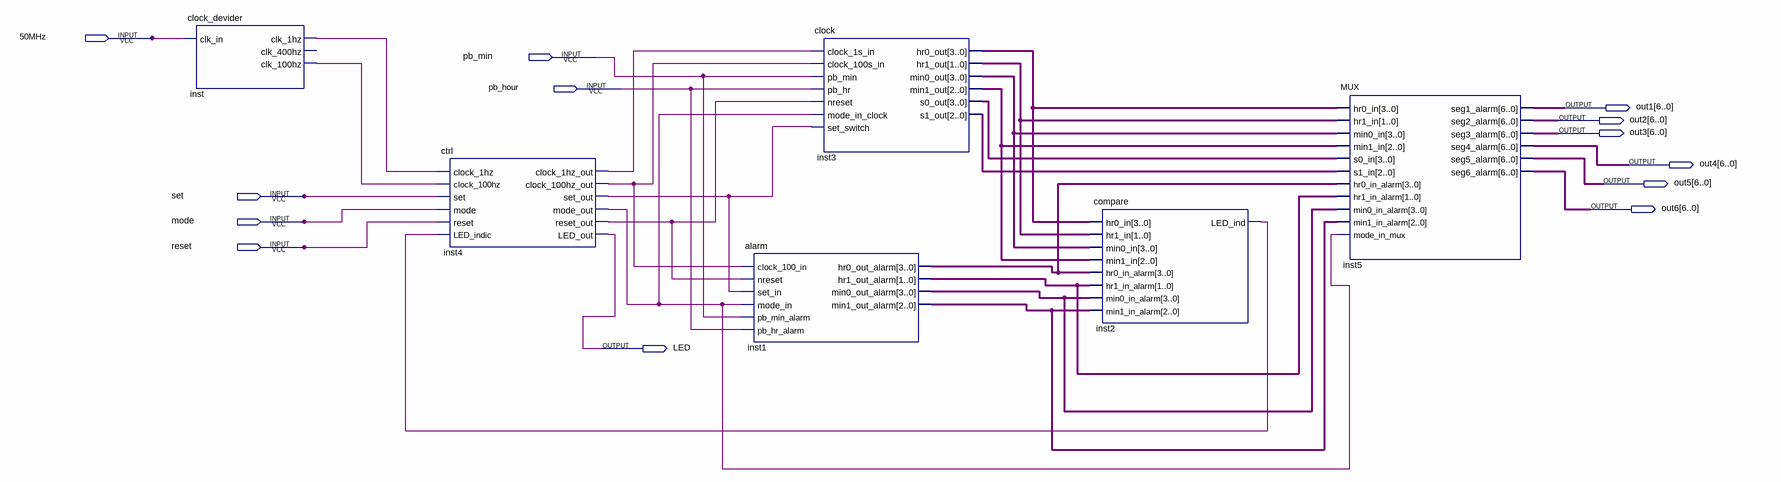
[diagram p0: schematic sheet]
// Quartus schematic Test_proj.bdf as structural Verilog: 6 symbols, 13 pins
module Test_proj (
  input  \50MHz ,
  input  pb_min,
  input  pb_hour,
  input  set,
  input  mode,
  input  reset,
  output [6:0] out1,
  output [6:0] out2,
  output [6:0] out3,
  output [6:0] out4,
  output [6:0] out5,
  output [6:0] out6,
  output LED
);

  wire inst2_led_ind, inst4_clock_1hz_out, inst4_clock_100hz_out, inst4_mode_out, inst4_reset_out,
       inst4_set_out, inst_clk_1hz, inst_clk_100hz;
  wire [1:0] inst1_hr1_out_alarm, inst3_hr1_out;
  wire [2:0] inst1_min1_out_alarm, inst3_min1_out, inst3_s1_out;
  wire [3:0] inst1_hr0_out_alarm, inst1_min0_out_alarm, inst3_hr0_out, inst3_min0_out, inst3_s0_out;

  clock_devider inst (.clk_in(\50MHz ), .clk_1hz(inst_clk_1hz), .clk_100hz(inst_clk_100hz));  // open: clk_400hz
  ctrl inst4 (
    .clock_1hz(inst_clk_1hz), .clock_100hz(inst_clk_100hz), .set(set), .mode(mode), .reset(reset),
    .LED_indic(inst2_led_ind), .clock_1hz_out(inst4_clock_1hz_out), .clock_100hz_out(inst4_clock_100hz_out),
    .set_out(inst4_set_out), .mode_out(inst4_mode_out), .reset_out(inst4_reset_out), .LED_out(LED));
  alarm inst1 (
    .clock_100_in(inst4_clock_100hz_out), .nreset(inst4_reset_out), .set_in(inst4_set_out),
    .mode_in(inst4_mode_out), .pb_min_alarm(pb_min), .pb_hr_alarm(pb_hour),
    .hr0_out_alarm(inst1_hr0_out_alarm), .hr1_out_alarm(inst1_hr1_out_alarm),
    .min0_out_alarm(inst1_min0_out_alarm), .min1_out_alarm(inst1_min1_out_alarm));
  clock inst3 (
    .clock_1s_in(inst4_clock_1hz_out), .clock_100s_in(inst4_clock_100hz_out), .pb_min(pb_min),
    .pb_hr(pb_hour), .nreset(inst4_reset_out), .mode_in_clock(inst4_mode_out), .set_switch(inst4_set_out),
    .hr0_out(inst3_hr0_out), .hr1_out(inst3_hr1_out), .min0_out(inst3_min0_out), .min1_out(inst3_min1_out),
    .s0_out(inst3_s0_out), .s1_out(inst3_s1_out));
  compare inst2 (
    .hr0_in(inst3_hr0_out), .hr1_in(inst3_hr1_out), .min0_in(inst3_min0_out), .min1_in(inst3_min1_out),
    .hr0_in_alarm(inst1_hr0_out_alarm), .hr1_in_alarm(inst1_hr1_out_alarm),
    .min0_in_alarm(inst1_min0_out_alarm), .min1_in_alarm(inst1_min1_out_alarm), .LED_ind(inst2_led_ind));
  MUX inst5 (
    .hr0_in(inst3_hr0_out), .hr1_in(inst3_hr1_out), .min0_in(inst3_min0_out), .min1_in(inst3_min1_out),
    .s0_in(inst3_s0_out), .s1_in(inst3_s1_out), .hr0_in_alarm(inst1_hr0_out_alarm),
    .hr1_in_alarm(inst1_hr1_out_alarm), .min0_in_alarm(inst1_min0_out_alarm),
    .min1_in_alarm(inst1_min1_out_alarm), .mode_in_mux(inst4_mode_out), .seg1_alarm(out1), .seg2_alarm(out2),
    .seg3_alarm(out3), .seg4_alarm(out4), .seg5_alarm(out5), .seg6_alarm(out6));
endmodule
